# Altium schematic sheet LFR_A_v2.SchDoc
size A; SheetNumber: 1; SheetTotal: 1
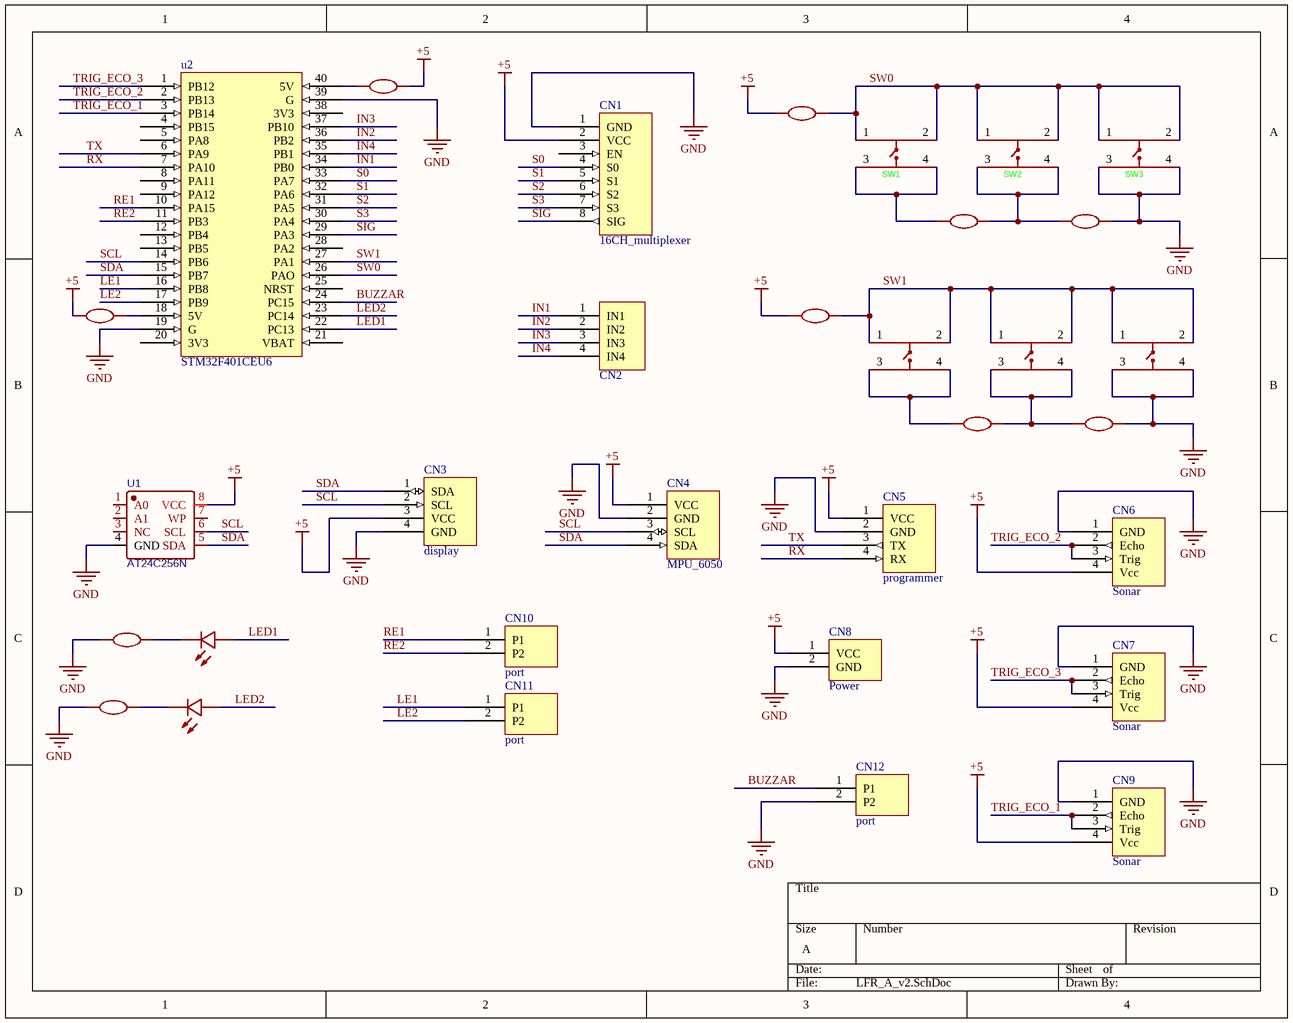
[diagram p0: LFR_A_v2.SchDoc]

## Parts
CN1  16CH_multiplexer  [16CH_MUX]
CN2  M_Driver  [M_driver]  (value not drawn)
CN3  display  [display]
CN4  MPU_6050  [mpu_6050]
CN5  programmer  [Sonar]
CN6  Sonar  [Sonar]
CN7  Sonar  [Sonar]
CN8  Power  [power]
CN9  Sonar  [Sonar]
CN10  port  [power]
CN11  port  [power]
CN12  port  [power]
LED1  333-2SURD/S530-A3  [LED-TH_BD5.9-P2.54-RD_RED]  (value not drawn)
LED2  333-2SURD/S530-A3  [LED-TH_BD5.9-P2.54-RD_RED]  (value not drawn)
R1  10kΩ  [regsistor]  (value not drawn)
R2  10kΩ  [regsistor]  (value not drawn)
R3  10kΩ  [regsistor]  (value not drawn)
R4  10kΩ  [regsistor]  (value not drawn)
R5  10kΩ  [regsistor]  (value not drawn)
R6  10kΩ  [regsistor]  (value not drawn)
R7  10kΩ  [regsistor]  (value not drawn)
R8  10kΩ  [regsistor]  (value not drawn)
R9  10kΩ  [regsistor]  (value not drawn)
R10  10kΩ  [regsistor]  (value not drawn)
SW1  1825910-7  [button]  (value not drawn)
SW2  1825910-7  [button]  (value not drawn)
SW3  1825910-7  [button]  (value not drawn)
SW4  1825910-7  [button]  (value not drawn)
SW5  1825910-7  [button]  (value not drawn)
SW6  1825910-7  [button]  (value not drawn)
U1  AT24C256N  [DIP-8_L9.8-W6.6-P2.54-LS7.6-BL]
u2  STM32F401CEU6  [STM32F411CE]

## Nets
+5: CN1.2(VCC) CN3.3(VCC) CN4.1(VCC) CN5.1(VCC) CN6.4(Vcc) CN7.4(Vcc) CN8.1(VCC) CN9.4(Vcc) R1.1 R4.1 R7.2 R8.2 U1.8(VCC)
GND: CN1.1(GND) CN3.4(GND) CN4.2(GND) CN5.2(GND) CN6.1(GND) CN7.1(GND) CN8.2(GND) CN9.1(GND) CN12.2(P2) R3.2 R6.2 R9.1 R10.1 SW3.3 SW3.4 SW6.3 SW6.4 U1.4(GND) u2.19(G) u2.39(G)
BUZZAR: CN12.1(P1) u2.24(PC15)
IN1: CN2.1(IN1) u2.34(PB0)
IN2: CN2.2(IN2) u2.36(PB2)
IN3: CN2.3(IN3) u2.37(PB10)
IN4: CN2.4(IN4) u2.35(PB1)
LE1: CN11.1(P1) u2.16(PB8)
LE2: CN11.2(P2) u2.17(PB9)
LED1: LED1.2(A) u2.22(PC13)
LED2: LED2.2(A) u2.23(PC14)
RE1: CN10.1(P1) u2.10(PA15)
RE2: CN10.2(P2) u2.11(PB3)
RX: CN5.4(RX) u2.7(PA10)
S0: CN1.4(S0) u2.33(PA7)
S1: CN1.5(S1) u2.32(PA6)
S2: CN1.6(S2) u2.31(PA5)
S3: CN1.7(S3) u2.30(PA4)
SCL: CN3.2(SCL) CN4.3(SCL) U1.6(SCL) u2.14(PB6)
SDA: CN3.1(SDA) CN4.4(SDA) U1.5(SDA) u2.15(PB7)
SIG: CN1.8(SIG) u2.29(PA3)
SW0: R1.2 SW1.1 SW1.2 SW2.1 SW2.2 SW3.1 SW3.2 u2.26(PAO)
SW1: R4.2 SW4.1 SW4.2 SW5.1 SW5.2 SW6.1 SW6.2 u2.27(PA1)
TRIG_ECO_1: CN9.2(Echo) CN9.3(Trig) u2.3(PB14)
TRIG_ECO_2: CN6.2(Echo) CN6.3(Trig) u2.2(PB13)
TRIG_ECO_3: CN7.2(Echo) CN7.3(Trig) u2.1(PB12)
TX: CN5.3(TX) u2.6(PA9)
NetLED1_1: LED1.1(C) R9.2
NetLED2_1: LED2.1(C) R10.2
NetR2_1: R2.1 SW1.3 SW1.4
NetR2_2: R2.2 R3.1 SW2.3 SW2.4
NetR5_1: R5.1 SW4.3 SW4.4
NetR5_2: R5.2 R6.1 SW5.3 SW5.4
NetR7_1: R7.1 u2.40(5V)
NetR8_1: R8.1 u2.18(5V)

Not connected (* = marked no-connect by the designer): CN1 3(EN); U1 1(A0) 2(A1) 3(NC) 7(WP); u2 4(PB15) 5(PA8) 8(PA11) 9(PA12) 12(PB4) 13(PB5) 20(3V3) 21(VBAT) 25(NRST) 28(PA2) 38(3V3)

## Library data of the parts
LED1 LED2 = LED: Manufacturer: EVERLIGHT(亿光); Add into BOM: yes; Lamp Holder Type: 5mm圆形灯头; Emitted Color: Red; Forward Voltage (VF): 2V; Forward Current: 20mA; Dominant Wavelength: 624nm; Peak Wavelength: 632nm; Lens Color: 红色透镜; Luminous Intensity: 200mcd; Viewing Angle: 30°; Symbol: 333-2SURD/S530-A3; Device: 333-2SURD/S530-A3; LCSC Part Name: 333-2SURD/S530-A3; Supplier Part: C87271; Manufacturer Part: 333-2SURD/S530-A3; Supplier Footprint: 插件,D=5mm; JLCPCB Part Class: Extended Part; Datasheet: https://atta.szlcsc.com/upload/public/pdf/source/20161119/1479540195109.pdf; Supplier: LCSC; Convert to PCB: yes
R1-R10 = reg_10k: Manufacturer: VISHAY(威世); Symbol: MBB02070C1002FCT00; Add into BOM: yes; Tolerance: ±1%; Power(Watts): 600mW; Temperature Coefficient: ±50ppm/℃; Device: MBB02070C1002FCT00; LCSC Part Name: 金属膜电阻 10kΩ ±1% 600mW; Supplier Part: C1364513; Manufacturer Part: MBB02070C1002FCT00; Supplier Footprint: 插件,D2.5xL6.5mm; JLCPCB Part Class: Extended Part; Datasheet: https://atta.szlcsc.com/upload/public/pdf/source/20210430/B7BC0816ABBF03221EE8A99AEEE87AD9.pdf; Supplier: LCSC; Convert to PCB: yes; Type: Metal Film Resistors; Value: 10kΩ; Operating Temperature Range: -55℃~+155℃
SW1-SW6 = button: Manufacturer: TE Connectivity(泰科电子); Add into BOM: yes; Circuit: SPST; Actuator Style: Round Button; Operating Force: 2.6N; Switch Height: 5mm; Strike Gundam: Without bracket; Contact Current: 50mA; Voltage Rating: 24V; Actuator/Cap Color: Red; Symbol: 1825910-7; Device: 1825910-7; LCSC Part Name: 5.99*5.99*5mm 直插 轻触开关; Supplier Part: C592731; Manufacturer Part: 1825910-7; Supplier Footprint: 插件; JLCPCB Part Class: Extended Part; Datasheet: https://atta.szlcsc.com/upload/public/pdf/source/20190912/C428628_64BAA15C1B0D0A7FBB2C11BEC7714D6D.pdf; Supplier: LCSC; Convert to PCB: yes; Mounting Type: Straight; Length: 5.99mm; Width: 5.99mm; Termination Style: PCPin; Life: -; Operating Temperature: -35℃~+85℃
U1 = AT24C256N: Manufacturer: HGSEMI(华冠); Contributor: LCSC; Supplier: LCSC; Supplier Part: C434602; Manufacturer Part: AT24C256N; JLCPCB Part Class: Extended Part; spicePre: U; spiceSymbolName: AT24C256N